# EasyEDA Pro project ZIAD_DBW_PROJECT_EDIT_9_MAY_2025.epro, board DBW_v4.1
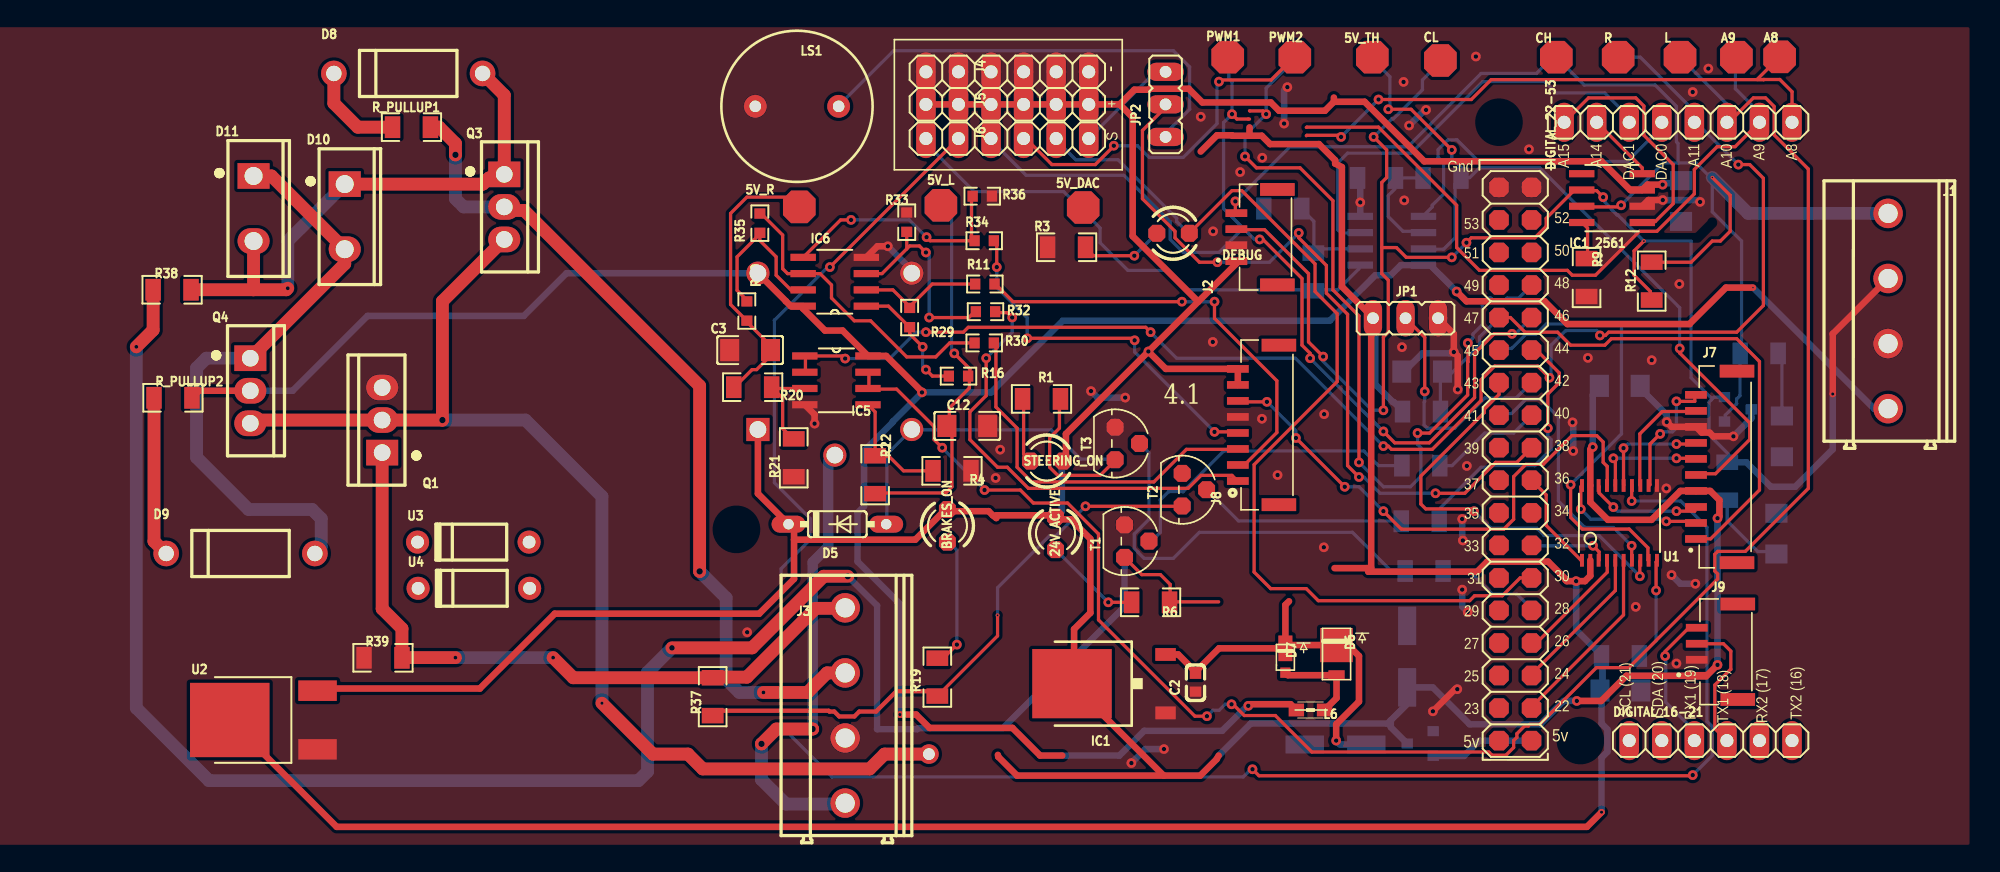
[diagram p13: board, top side]
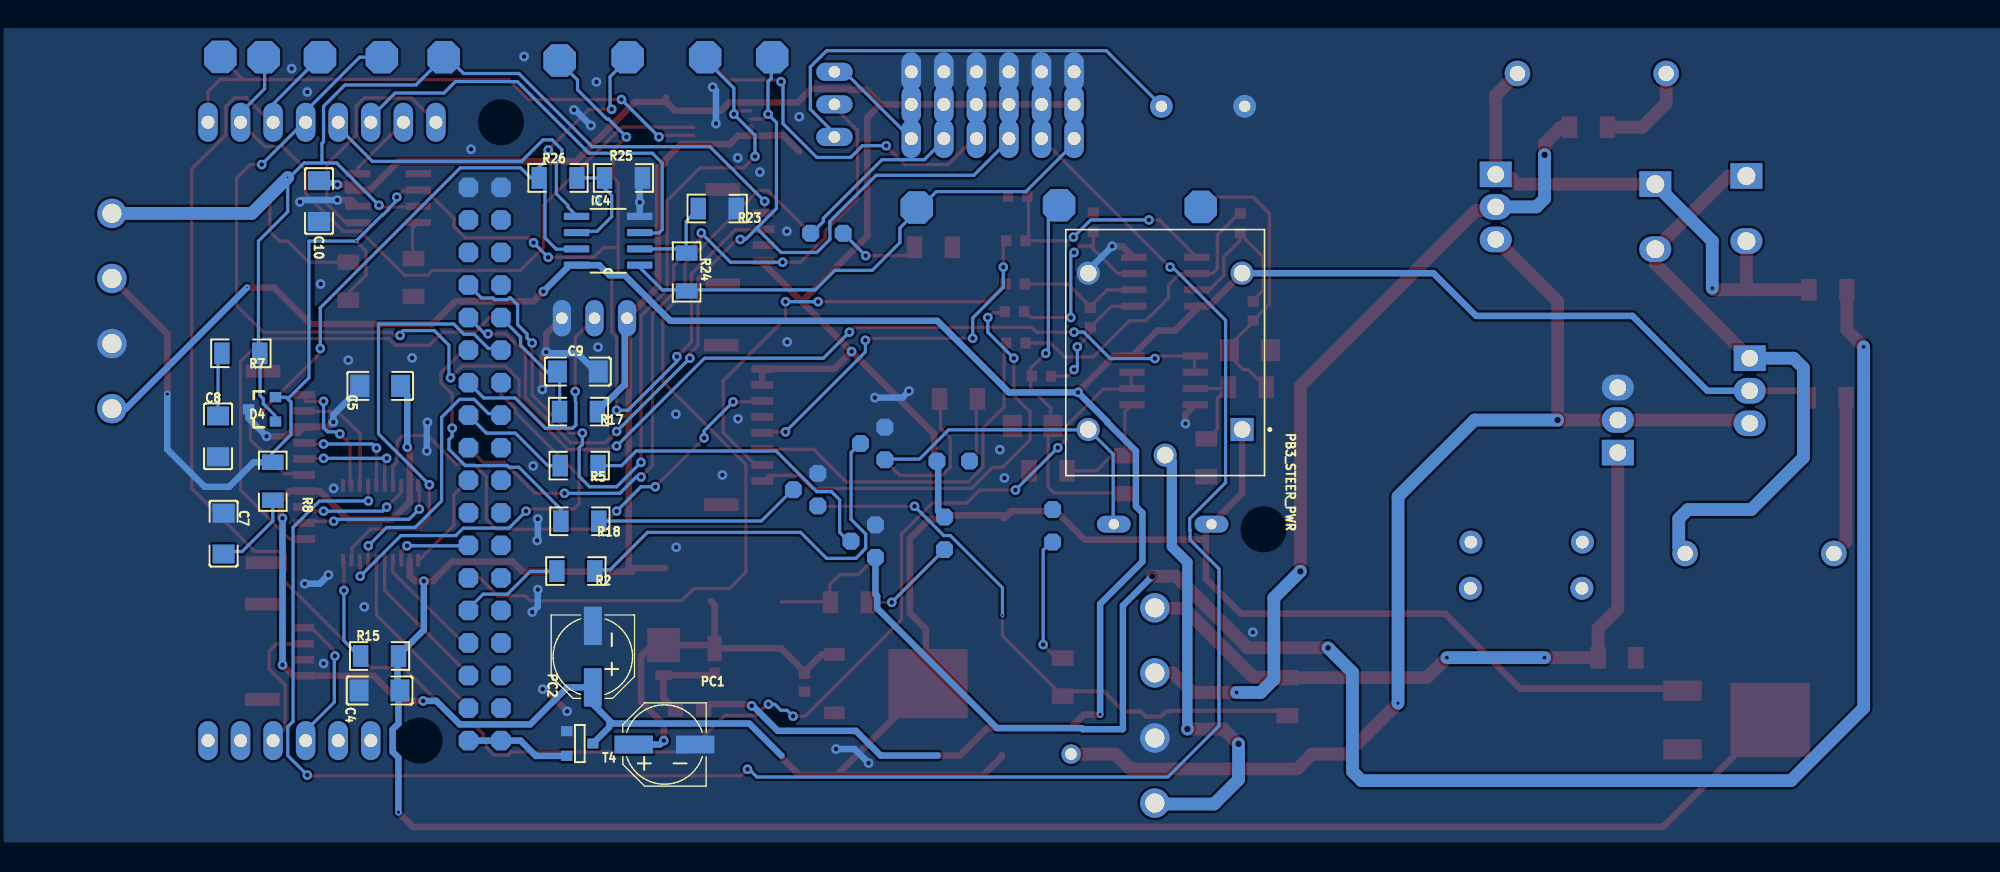
[diagram p14: board, bottom side, seen from below]

Outline 152.02 x 64.06 mm; copper layers: Top Layer, Bottom Layer. Coordinates in mm from the lower left corner of the outline.
Outline path: 0,63.17 0,3.18 ; 53.21,63.93 139.32,63.93 ; 53.34,0 139.45,0 ; 152.02,4.06 152.02,64.06
Stack: Top Layer 0.035mm / Dielectric1 1.51mm FR4 er 4.5 / Bottom Layer 0.035mm

## Design rules (mm)
spacing safeClearance (default): track to track 0.254, other pairs 0.254 to 1.016
spacing Power: track to track 0.254, other pairs 0.254 to 1.016
spacing High Current: track to track 0.762, other pairs 0.762 to 1.016
spacing SPI_Signals: track to track 0.254, other pairs 0.254 to 1.016
spacing Oscillator: track to track 0.508, other pairs 0.508 to 1.016
track width trackWidth (default): min 0.254, default 0.254, max 2.54
track width Power: min 0.508, default 0.508, max 2.54
track width High Current: min 0.508, default 0.508, max 2.54
track width SPI_Signals: min 0.254, default 0.254, max 2.54
track width Oscillator: min 0.254, default 0.254, max 2.54
differential pair differentialPair (default): width min 0.127, default 0.254, max 2.54; gap min 0.152, default 0.152
via viaSize: diameter min 0.35, default 0.35, max 2.6; hole min 0.35, default 0.35, max 2
via default: diameter min 0.305, default 0.305, max 2.6; hole min 0.305, default 0.305, max 2
via Power: diameter min 0.305, default 0.305, max 2.6; hole min 0.305, default 0.305, max 2
via High Current: diameter min 0.305, default 0.305, max 2.6; hole min 0.305, default 0.305, max 2
via SPI_Signals (default): diameter min 0, default 0, max 2.6; hole min 0, default 0, max 2
via Oscillator: diameter min 0, default 0, max 2.6; hole min 0, default 0, max 2
net GND uses CopperRegion1, Power
net ARD+5V uses Power
net 12V_PROTECTION uses Power
net +3V3 uses Power
net +12V uses Power
net +5V uses Power
net +24V uses High Current
net 12V_OUT uses High Current
net SOLENOID_POWER uses High Current
pour ie1 uses CopperRegion

## Placement (name value [footprint] x y rotation side)
5V_DAC  PTR1PAD1-17  [P1-17]  82.5 49.86 0 top
5V_L  PTR1PAD1-17  [P1-17]  71.4 50.04 0 top
5V_R  PTR1PAD1-17  [P1-17]  60.35 49.91 0 top
5V_TH  PTR1PAD1-17  [P1-17]  105.05 61.6 0 top
24V_ACTIVE  LED3  [LED3MM]  80.34 24.44 270 top
A8  PTR1PAD1-17  [P1-17]  136.83 61.62 0 top
A9  PTR1PAD1-17  [P1-17]  133.45 61.6 0 top
ANALOG_A8-A15  ANALOG_A8-A15  [1X08]  128.91 56.52 180 top
BRAKES_ON  LED2  [LED3MM]  71.91 25.02 270 top
C2  100n  [C0603]  91.26 12.78 90 top
C3  1uF  [C1206]  56.51 38.74 180 top
C4  0.1uF  [C1206]  124.41 12.17 0 bottom
C5  0.1uF  [C1206]  124.36 35.94 0 bottom
C7  560pF  [C1206]  136.58 24.41 90 bottom
C8  560pF  [C1206]  137.01 32 270 bottom
C9  1uF  [C1206]  108.94 37.06 180 bottom
C10  0.1uF  [C1206]  129.13 50.37 270 bottom
C12  1uF  [C1206]  73.46 32.82 0 top
CH  PTR1PAD1-17  [P1-17]  119.41 61.6 180 top
CL  PTR1PAD1-17  [P1-17]  110.36 61.34 0 top
D4  PESD1CAN  [SPARKFUN-DISCRETESEMI_SOT23-3]  133.53 34.11 90 bottom
D5  1N4148DO35-7  [DO35-7]  63.32 25.15 0 top
D6  SS1P3L  [DO220AAL]  102.26 15.01 270 top
D7  MSS1P3L-M3/89A  [MICROSMP]  98.27 14.76 270 top
D8  P6KE15A  [DO-15_BD3.1-L6.7-P10.70-D0.9-RD]  29.84 60.33 0 top
D9  P6KE15A  [DO-15_BD3.1-L6.7-P10.70-D0.9-RD]  16.76 22.86 0 top
D10  MBR1045  [TO-220AC_L10.0-W4.5-P5.08-T]  24.89 49.15 0 top
D11  MBR1045  [TO-220AC_L10.0-W4.5-P5.08-T]  17.78 49.78 0 top
DEBUG  DS1  [LED3MM]  89.51 47.85 180 top
DIGITAL_16-21  DIGITAL_16-21  [1X06]  131.44 8.26 0 top
DIGITAL_22-53  Digital 22-53  [PINHEAD_2X18]  116.2 29.85 270 top
IC1  MC33269?D  [DPACK]  84.12 12.7 90 top
IC1_2561  MCP2561-E/SN  [SOIC8-N_MC_MCH]  123.75 50.6 180 top
IC4  LM358D  [D8]  106.58 47.27 0 bottom
IC5  LM358D  [D8]  63.25 36.37 0 top
IC6  LM358D  [D8]  63.12 44.07 180 top
J1  DB128V-5.08-4P-GN-S  [CONN-TH_4P-P5.08_DIBO_DB128V-5.08]  145.29 41.78 90 top
J2  CAN_2  [JST_SM04B-GHS-TB(LF)(SN)-]  96.72 47.55 90 top
J3  DB128V-5.08-4P-GN-S  [CONN-TH_4P-P5.08_DIBO_DB128V-5.08]  63.93 11 90 top
J4  Ground  [1X06]  76.58 60.45 0 top
J5  Power  [1X06]  76.58 57.91 0 top
J6  Signal  [1X06]  76.58 55.25 0 top
J7  MOTOR  [JST_SM10B-GHS-TB(LF)(SN)]  133.5 29.62 90 top
J8  STEERING  [JST_SM08B-GHS-TB(LF)(SN)]  94.56 32.89 90 top
J9  ROS_CONN  [JST_SM04B-GHS-TB(LF)(SN)-]  132.64 15.19 90 top
JP1  3 pin  [JP2]  107.64 41.22 0 top
JP2  3 pin  [JP2]  88.93 57.91 90 top
L  PTR1PAD1-17  [P1-17]  129.06 61.6 0 top
L6  MH2029-300Y  [0805]  100.23 10.64 180 top
LS1  BUZZER-PTH  [BUZZER-12MM]  60.17 57.76 0 top
NOREF  -  [Pad_e752]  70.47 7.2 0 top
PB3_STEER_PWR  ORWH-SH-105D1F,000  [TE_ORWH-SH-105D1F,000]  57.12 32.54 90 bottom
PC1  47u  [PANASONIC_D]  102.18 7.95 0 bottom
PC2  47u  [PANASONIC_D]  107.77 14.81 270 bottom
PWM1  PTR1PAD1-17  [P1-17]  93.78 61.6 0 top
PWM2  PTR1PAD1-17  [P1-17]  99.01 61.6 0 top
Q1  IRLZ44NPBF  [TO-220-3_L10.0-W4.5-P2.54-T]  27.81 33.27 180 top
Q3  IRF4905PBF  [TO-220-3_L10.0-W4.5-P2.54-T]  37.34 49.91 0 top
Q4  IRF4905PBF  [TO-220-3_L10.0-W4.5-P2.54-T]  17.53 35.56 0 top
R  PTR1PAD1-17  [P1-17]  124.23 61.6 0 top
R1  1K  [R1206]  79.25 34.93 180 top
R2  1K  [R1206]  109.09 21.49 180 bottom
R3  1K  [R1206]  81.2 46.76 0 top
R4  10K  [R1206]  72.26 29.31 180 top
R5  1K  [R1206]  108.84 29.72 180 bottom
R6  1K  [R1206]  87.76 19.05 180 top
R7  100  [R1206]  135.23 38.48 180 bottom
R8  100  [R1206]  132.74 28.5 90 bottom
R9  4.7k  [R1206]  121.77 44.4 90 top
R10  4.7K  [R0603]  56.26 41.78 90 top
R11  22k  [R0603]  74.83 43.89 180 top
R12  120  [R1206]  126.85 44.12 90 top
R15  10K  [R1206]  124.41 14.86 180 bottom
R16  4.7K  [R0603]  72.77 36.7 180 top
R17  4.7K  [R1206]  108.89 33.93 0 bottom
R18  1K  [R1206]  108.79 25.37 180 bottom
R19  1K  [R1206]  71.12 13.21 90 top
R20  5.151K  [R1206]  56.72 35.84 180 top
R21  10K  [R1206]  59.92 30.33 270 top
R22  5.151K  [R1206]  66.27 29.01 270 top
R23  10K  [R1206]  98.07 49.78 0 bottom
R24  5.151K  [R1206]  100.46 44.83 270 bottom
R25  10K  [R1206]  105.38 52.17 0 bottom
R26  5.151K  [R1206]  110.49 52.17 0 bottom
R29  22k  [R0603]  68.96 41.28 90 top
R30  22k  [R0603]  74.78 39.29 0 top
R32  22k  [R0603]  74.88 41.73 180 top
R33  22k  [R0603]  68.73 48.72 270 top
R34  22k  [R0603]  74.78 47.27 180 top
R35  22k  [R0603]  57.28 48.64 270 top
R36  22k  [R0603]  74.62 50.75 0 top
R37  150  [R1206]  53.59 11.68 90 top
R38  100  [R1206]  11.42 43.44 0 top
R39  10K  [R1206]  27.88 14.72 0 top
R_PULLUP1  10K  [R1206]  30.1 56.13 180 top
R_PULLUP2  10K  [R1206]  11.49 35.01 0 top
STEERING_ON  LED1  [LED3MM]  79.65 30.07 180 top
T1  2N3904  [TO92]  85.72 23.83 270 top
T2  2N3904  [TO92]  90.22 27.84 270 top
T3  2N3904  [TO92]  84.99 31.45 270 top
T4  PMV48XP  [SOT-23]  108.79 8 90 bottom
U1  TXB0108PWR  [TSSOP20]  124.33 25.25 0 top
U2  LM1117DT-2.5/NOPB  [TO-252-2_L6.6-W6.1-P4.57-LS9.7-BR-CW]  19.35 9.86 0 top
U3  1N5819  [DO-41_BD2.4-L4.7-P8.70-D0.6-RD]  34.92 23.75 0 top
U4  1N5819  [DO-41_BD2.4-L4.7-P8.70-D0.6-RD]  34.97 20.14 0 top

## Footprints (pads in the part's own frame, mm; a bottom-side part is the same pattern mirrored in y, then rotated)
1X06
  oval 1.524x3.048 hole 1.016: 1(-6.35,0) 2(-3.81,0) 3(-1.27,0) 4(1.27,0) 5(3.81,0) 6(6.35,0)
1X08
  oval 1.524x3.048 hole 1.016: 1(-8.89,0) 2(-6.35,0) 3(-3.81,0) 4(-1.27,0) 5(1.27,0) 6(3.81,0) 7(6.35,0) 8(8.89,0)
0805
  rect 1.2x1 smd: 1(-1.1,0) 2(1.1,0)
BUZZER-12MM
  round 1.778 hole 0.9: +(3.25,0) -(-3.25,0)
C0603
  rect 0.8x0.9 smd: 1(-0.7,0) 2(0.7,0)
C1206
  rect 1.485x1.728 smd: 1(-1.593,0) 2(1.593,0)
CONN-TH_4P-P5.08_DIBO_DB128V-5.08
  round 2.3 hole 1.5: 1(-7.62,0) 2(-2.54,0) 3(2.54,0) 4(7.62,0)
D8
  rect 1.981x0.559 smd: 1(-2.464,1.905) 2(-2.464,0.635) 3(-2.464,-0.635) 4(-2.464,-1.905) 5(2.464,-1.905) 6(2.464,-0.635) 7(2.464,0.635) 8(2.464,1.905)
DO35-7
  oval 2.642x1.321 hole 0.813: A(3.81,0) C(-3.81,0)
DO220AAL
  rect 2.667x2.54 smd: P$1(-0.7,0)
  rect 0.762x1.27 smd: P$2(1.65,0)
DO-15_BD3.1-L6.7-P10.70-D0.9-RD
  round 2 hole 1.2: 1(-5.8,0) 2(5.8,0)
DO-41_BD2.4-L4.7-P8.70-D0.6-RD
  round 1.8 hole 1: 1(-4.35,0) 2(4.35,0)
DPACK
  rect 1x1.6 smd: 1(-2.28,-4.8) 3(2.28,-4.8)
  rect 5.4x6.2 smd: 2(0,2.5)
JP2
  oval 1.423x2.845 hole 0.914: 1(-2.54,0) 2(0,0) 3(2.54,0)
JST_SM04B-GHS-TB(LF)(SN)-
  rect 0.6x1.7 smd: 1(-1.875,2.275) 2(-0.625,2.275) 3(0.625,2.275) 4(1.875,2.275)
  rect 1x2.7 smd: SH1(-3.725,-0.925) SH2(3.725,-0.925)
JST_SM08B-GHS-TB(LF)(SN)
  rect 0.6x1.7 smd: 1(-4.375,0) 2(-3.125,0) 3(-1.875,0) 4(-0.625,0) 5(0.625,0) 6(1.875,0) 7(3.125,0) 8(4.375,0)
  rect 1x2.7 smd: SH1(-6.225,-3.2) SH2(6.225,-3.2)
JST_SM10B-GHS-TB(LF)(SN)
  rect 0.6x1.7 smd: 1(-5.625,3.2) 2(-4.375,3.2) 3(-3.125,3.2) 4(-1.875,3.2) 5(-0.625,3.2) 6(0.625,3.2) 7(1.875,3.2) 8(3.125,3.2) 9(4.375,3.2) 10(5.625,3.2)
  rect 1x2.7 smd: S1(-7.475,0) S2(7.475,0)
LED3MM
  custom 1.321x1.321 hole 0.813: A(-1.27,0) K(1.27,0)
MICROSMP
  rect 0.8x0.8 smd: A(1.2,0)
  rect 2x1.1 smd: K(-0.7,0)
P1-17
  custom 2.54x2.54 hole 1.702: TP(0,0)
Pad_e752
  round 1.524 hole 0.914: 1(0,0)
PANASONIC_D
  rect 3x1.4 smd: +(2.4,0) -(-2.4,0)
PINHEAD_2X18
  custom 1.524x1.524 hole 1.016: 1(-21.59,-1.27) 2(-21.59,1.27) 3(-19.05,-1.27) 4(-19.05,1.27) 5(-16.51,-1.27) 6(-16.51,1.27) 7(-13.97,-1.27) 8(-13.97,1.27) 9(-11.43,-1.27) 10(-11.43,1.27) 11(-8.89,-1.27) 12(-8.89,1.27) 13(-6.35,-1.27) 14(-6.35,1.27) 15(-3.81,-1.27) 16(-3.81,1.27) 17(-1.27,-1.27) 18(-1.27,1.27) 19(1.27,-1.27) 20(1.27,1.27) 21(3.81,-1.27) 22(3.81,1.27) 23(6.35,-1.27) 24(6.35,1.27) 25(8.89,-1.27) 26(8.89,1.27) 27(11.43,-1.27) 28(11.43,1.27) 29(13.97,-1.27) 30(13.97,1.27) 31(16.51,-1.27) 32(16.51,1.27) 33(19.05,-1.27) 34(19.05,1.27) 35(21.59,-1.27) 36(21.59,1.27)
R0603
  rect 0.806x0.864 smd: 1(-0.753,0) 2(0.753,0)
R1206
  rect 1.208x1.701 smd: 1(-1.479,0) 2(1.479,0)
SOIC8-N_MC_MCH
  rect 1.981x0.559 smd: 1(-2.362,1.905) 2(-2.362,0.635) 3(-2.362,-0.635) 4(-2.362,-1.905) 5(2.362,-1.905) 6(2.362,-0.635) 7(2.362,0.635) 8(2.362,1.905)
SOT-23
  rect 0.787x0.889 smd: 1(0.025,-1.016) 2(-0.94,1.016) 3(0.991,1.016)
SPARKFUN-DISCRETESEMI_SOT23-3
  rect 0.8x0.9 smd: 1(-0.95,-1) 2(0.95,-1) 3(0,1.1)
TE_ORWH-SH-105D1F,000
  rect 1.808x1.808 hole 1.3: 1(0,0)
  round 1.808 hole 1.3: 2(0,12) 3(-2,6) 4(12.2,0) 5(12.2,12)
TO92
  custom 1.321x1.321 hole 0.813: 1(1.27,0) 2(0,1.905) 3(-1.27,0)
TO-220-3_L10.0-W4.5-P2.54-T
  rect 2.5x2 hole 1.3: 1(0,2.54)
  oval 2.5x2 hole 1.3: 2(0,0) 3(0,-2.54)
TO-220AC_L10.0-W4.5-P5.08-T
  rect 2.5x2 hole 1.4: 1(0,2.54)
  oval 2.5x2 hole 1.4: 2(0,-2.54)
TO-252-2_L6.6-W6.1-P4.57-LS9.7-BR-CW
  rect 3x1.6 smd: 1(3.424,-2.29) 3(3.424,2.29)
  rect 6.2x5.8 smd: 2(-3.424,0)
TSSOP20
  rect 0.305x0.991 smd: 1(-2.925,-2.918) 2(-2.275,-2.918) 3(-1.625,-2.918) 4(-0.975,-2.918) 5(-0.325,-2.918) 6(0.325,-2.918) 7(0.975,-2.918) 8(1.625,-2.918) 9(2.275,-2.918) 10(2.925,-2.918) 11(2.925,2.918) 12(2.275,2.918) 13(1.625,2.918) 14(0.975,2.918) 15(0.325,2.918) 16(-0.325,2.918) 17(-0.975,2.918) 18(-1.625,2.918) 19(-2.275,2.918) 20(-2.925,2.918)

## Nets
As in the schematic, except:
+3V3: C4.1 JP1.1 R15.2 R17.1 U1.2 U2.2
SOLENOID_POWER: NOREF.1 Q1.2 Q3.3 Q4.3

Pads without a net: DIGITAL_22-53 3 4 5 6 7 17 19 21 22 23 25 27 29 31 33; IC1_2561 5; J2 SH1 SH2; J7 S1 S2; J8 SH1 SH2; J9 SH1 SH2; U3 1 2; U4 1 2

## Via types
v1: diameter 0.756, hole 0.35, Top Layer to Bottom Layer, 150 vias
v2: diameter 0.5, hole 0.25, Top Layer to Bottom Layer, 4 vias
v3: diameter 0.305, hole 0.15, Top Layer to Bottom Layer, 2 vias
v4: diameter 0.25, hole 0.125, Top Layer to Bottom Layer, 2 vias
v5: diameter 0.5, hole 0.3, Top Layer to Bottom Layer, 4 vias
v6: diameter 1, hole 0.5, Top Layer to Bottom Layer, 5 vias
v7: diameter 0.5, hole 0.5, Top Layer to Bottom Layer, 1 via
v8: diameter 0.75, hole 0.44, Top Layer to Bottom Layer, 1 via
v9: diameter 0.5, hole 0.305, Top Layer to Bottom Layer, 1 via

## Routing (per net, layer and track width the routed paths; a pad name or vN(x,y) marks a point on that pad's centre or on a via; arc(x,y) is an arc through that point)
5V_BRAKE_PULSE: length 155.5
  Top Layer w0.254: v1(95.71,6.02) 96.22,5.51 130,5.51 v1(130.05,5.56) ; v1(125.29,26.96) 125.29,28.07 U1.14 ; 72.85,55.35 72.74,55.21 v1(62.74,45.21)
  Bottom Layer w0.254: v1(95.71,6.02) 95.58,6.02 94.98,5.42 62.91,5.42 58.93,9.4 58.93,11.42 58.95,11.44 58.95,12.59 58.93,12.61 58.93,21.67 61.18,23.92 61.18,24.68 61.21,24.71 61.21,25.58 58.41,28.38 58.41,41.07 62.55,45.21 v1(62.74,45.21) ; v1(130.05,5.56) 131.57,7.09 131.57,9.34 131.16,9.75 131.16,24.89 129.1,26.96 v1(125.29,26.96)
5V_DAC1: length 40.8
  Bottom Layer w0.254: 100.46,43.43 100.46,43.41 ; 100.46,43.43 102.36,43.43 104.01,45.09 104.01,45.34 IC4.1 ; 100.46,43.43 90.42,43.43 88.9,44.96 85.98,44.96 83.82,47.12 83.82,48.26 82.55,49.53 82.55,49.78 5V_DAC.TP 82.42,49.91 82.17,49.91 80.97,51.11 73.99,51.11 70.36,54.74 70.36,55.25 70.31,55.35
5V_EBIKE_POWER_IN: length 10
  Top Layer w0.254: v1(128.78,34.73) 130.21,34.73 130.21,35.21 J7.10 ; U1.12 126.71,28.23 126.71,31.4 v1(127.51,32.19)
  Bottom Layer w0.254: v1(127.51,32.19) 127.67,32.35 128.46,32.35 128.78,32.67 v1(128.78,34.73)
5V_FWDSW: length 11.3
  Top Layer w0.254: v1(121.32,26.32) 121.32,28.07 U1.20 ; v1(127.98,25.37) 130.21,25.37 J7.2
  Bottom Layer w0.254: v1(127.98,25.37) 127.83,25.53 122.11,25.53 v1(121.32,26.32)
5V_L_SENSE: length 29.9
  Top Layer w0.254: v1(72.44,38.48) 73.66,37.26 73.66,36.7 73.62,36.7 73.62,35.78 72.06,34.21 72.06,32.82 72.26,32.61 72.26,28.07 71.78,27.59 66.27,27.59
  Bottom Layer w0.254: v1(72.44,38.48) 72.24,38.68 72.24,49.2 5V_L.TP
5V_R_SENSE: length 22.3
  Top Layer w0.254: 55.3,35.84 56.67,37.21 57.02,37.21 57.91,38.1 57.91,39.28 56.26,40.93 56.26,41.02 54.99,42.29 54.99,49.4 56.26,50.67 59.59,50.67 5V_R.TP
5V_REGEN: length 8.7
  Top Layer w0.254: v1(124.65,31.08) 124.65,28.23 U1.15 ; v1(128.78,31.4) 130.21,31.4 J7.7
  Bottom Layer w0.254: v1(128.78,31.4) 124.97,31.4 v1(124.65,31.08)
5V_REVERSE: length 8.6
  Top Layer w0.254: U1.16 124.02,28.23 124.02,30.13 v1(123.86,30.29) ; J7.6 130.21,30.29 v1(128.78,30.29)
  Bottom Layer w0.254: v1(128.78,30.29) v1(123.86,30.29)
5V_SPEEDOMETER: length 9.2
  Top Layer w0.254: U1.13 125.92,28.23 125.92,32.19 127.67,33.94 130.21,33.94 J7.9
5V_STEER_PULSE: length 41.7
  Top Layer w0.254: U1.17 123.38,28.23 123.38,29.65 123.06,29.97 123.06,31.56 122.56,32.06 120.63,32.06 118.38,29.81 117.03,29.81 116.08,28.86 116.08,25.53 115.31,24.76 107.32,24.76 v1(105.92,26.16) ; J8.6 94.65,34.73 94.69,34.7 v1(96.83,34.7) ; v1(99.09,31.88) v1(102.9,28.07)
  Bottom Layer w0.254: v1(105.92,26.16) 104.01,28.07 v1(102.9,28.07) ; v1(96.83,34.7) 99.09,32.44 v1(99.09,31.88)
5V_THROTTLE: length 61.1
  Top Layer w0.254: v1(111.25,54.36) 108.08,57.53 v1(106.3,57.53) ; v1(129.03,38.86) 129.03,38.51 134.49,33.05 134.49,31.75 131.83,29.08 130.43,29.08 J7.5
  Bottom Layer w0.254: 111.91,52.17 112.01,52.2 112.65,52.2 113.41,52.96 118.11,52.96 129.03,42.04 v1(129.03,38.86) ; 111.91,52.17 111.89,52.07 111.51,51.69 111.51,47.5 110.62,46.61 109.09,46.61 109.04,46.63 ; 111.91,52.17 112.01,52.32 112.01,52.96 111.25,53.72 v1(111.25,54.36) ; v1(106.3,57.53) 106.43,57.66 106.43,60.07 105.16,61.34 105.16,61.6 5V_TH.TP
5V_WATCHDOG: length 9
  Top Layer w0.254: U1.18 122.75,28.07 122.75,27.59 v1(123.86,26.48) ; J7.3 130.21,26.48 130.21,26.16 v1(128.78,26.16)
  Bottom Layer w0.254: v1(128.78,26.16) 124.17,26.16 v1(123.86,26.48)
12V_OUT: length 36.7
  Top Layer w1: v6(57.4,8) 58.56,9.16 v6(61.39,9.16)
  Bottom Layer w0.813: PB3_STEER_PWR.3 62.6,30.02 62.6,23.38 61.39,22.17 v6(61.39,9.16)
  Bottom Layer w1: J3.1 63.86,3.3 59.31,3.3 57.4,5.21 v6(57.4,8)
12V_PROTECTION: length 30.5
  Top Layer w0.508: D7.K 93.09,15.46 91.26,13.63 89.91,14.98 IC1.3 ; D7.K 98.27,18.85 98.55,19.13 ; D7.K 98.53,15.71 D6.P$1 103.16,15.71 104.01,14.86 104.01,11.3 102.23,9.53 v1(102.23,8.26)
  Bottom Layer w0.508: v1(102.23,8.26) 102.54,7.95 PC1.+
+3V3: length 207.2
  Top Layer w0.508: 104.75,21.44 113.23,21.44 114.02,22.23 118.77,22.23 120.12,20.88 120.12,20.8 120.22,20.7 v1(120.95,20.7) 121.64,20.7 122.06,21.12 U1.2 ; 104.75,21.44 104.65,21.72 102.11,21.72 ; 104.75,21.44 104.97,21.72 104.97,41.08 JP1.1 104.97,41.4 102.68,43.69 102.68,53.02 102.16,53.29 102.16,53.55 100.89,54.81 97.08,54.81 96.43,55.46 95.47,55.46 ; 95.47,55.46 95.47,56.11 ; 95.47,55.46 94.14,55.46 94.11,55.5 92.94,55.5 91.67,54.23 ; U2.2 24.26,1.52 121.79,1.52 v2(122.94,2.67)
  Bottom Layer w0.508: v1(120.95,20.7) 120.95,16.89 123.01,14.84 123.01,12.17 ; 107.47,33.93 106.73,34.67 106.67,34.67 105.34,36 105.28,36 105.28,41.08 JP1.1 ; C4.1 122.94,12.05 122.94,9.59 123.39,9.13 123.39,7.38 122.94,6.93 v2(122.94,2.67)
+5V: length 317.5
  Top Layer w0.508: 88.77,5.52 91.63,5.52 92.9,6.79 93.07,7.09 ; 88.77,5.52 81.79,12.51 IC1.2 81.79,12.83 81.79,16.95 83.06,18.22 83.06,24 81.53,25.53 80.52,25.53 24V_ACTIVE.A 80.2,25.84 75.76,25.84 75.72,25.63 75.44,25.84 75.12,26.16 71.95,26.16 BRAKES_ON.A 71.63,26.16 69.41,23.94 59.94,23.94 ; 88.77,5.52 77.34,5.52 75.87,6.99 75.84,7.14 ; 59.94,23.94 59.94,20.88 57.23,18.16 41.27,18.16 35.43,12.32 22.94,12.32 U2.3 ; 59.94,23.94 59.94,24.71 D5.C 57.12,27.53 PB3_STEER_PWR.1 ; v1(121.01,11.35) 122.91,11.35 124.87,13.31 131.13,13.31 v1(131.98,14.17) ; v1(87.59,38.63) 88.94,37.27 J8.8 J8.7 ; v1(87.59,38.63) 81.15,32.19 81.15,30.29 STEERING_ON.A ; v1(87.59,38.63) 91.47,42.51 ; 85.34,57.91 83.06,57.91 83.01,57.89 82.74,57.91 80.52,57.91 80.47,57.89 80.2,57.91 77.98,57.91 77.93,57.89 77.66,57.91 75.44,57.91 75.39,57.89 75.12,57.91 72.9,57.91 72.85,57.89 72.58,57.91 70.36,57.91 70.31,57.89 ; 85.34,57.91 86.36,56.9 86.36,47.63 91.47,42.51 ; 85.34,57.91 86.49,59.06 87.63,59.06 87.71,59.13 90.73,59.13 91.8,58.06 97.13,58.06 97.78,57.41 101.36,57.41 102.06,58.12 ; 91.47,42.51 94.45,45.49 94.45,45.67 ; 102.06,58.12 104.45,58.12 109.1,53.47 122.94,53.47 125.17,51.23 IC1_2561.3 126.53,51.65 v1(127.7,51.65) ; 102.06,58.12 102.06,58.44 ; v1(122.25,31.17) 122.06,30.97 U1.19 122.06,26.86 123.43,25.49 126.83,25.49 129.09,27.74 J7.4 131.41,27.74 132.13,27.03 132.13,25.76 v1(131.98,25.61)
  Bottom Layer w0.508: 106.5,9.84 107.77,11.11 107.77,12.41 109.77,12.41 112.65,9.53 118.15,9.53 119.98,11.35 v1(121.01,11.35) ; 106.5,9.84 106.5,9.3 T4.1 ; 106.5,9.84 106.25,9.59 95.57,9.59 93.07,7.09 ; v1(131.98,25.61) v1(131.98,14.17) ; 129.13,51.77 127.82,51.77 v1(127.7,51.65) ; 24V_ACTIVE.A 80.52,25.84 80.84,26.16 80.84,29.97 STEERING_ON.A ; v1(122.25,31.17) 122.25,35.23 122.96,35.94
+12V: length 214.2
  Top Layer w0.508: v2(68.2,10.29) 69.47,10.29 70.51,9.25 76.98,9.25 79.14,7.09 80.87,7.09 ; v4(134.75,43.61) 132.64,43.61 129.79,40.77 120.27,40.77 118.49,42.55 112.39,42.55 v1(111.63,43.31) ; L6.2 98.68,11.1 95.5,11.1 v1(95.38,10.97) ; PB3_STEER_PWR.4 59.31,42.55 59.31,42.55 59.69,42.16 IC6.8 60.66,41.96 62.36,40.26 63.73,40.26 65.71,38.28 67.13,38.28 69.92,35.49 v1(69.92,35.43) ; Q4.2 13.52,35.56 R_PULLUP2.2
  Bottom Layer w0.508: v1(95.38,10.97) 95.3,10.97 93.34,9.02 87.25,9.02 85.32,7.09 80.87,7.09 ; v4(134.75,43.61) 144.2,34.16 J1.1 ; Q4.2 20.83,35.56 26.67,41.4 38.86,41.4 42.2,44.74 PB3_STEER_PWR.4 ; v1(111.63,43.31) 109.58,45.36 107.27,45.36 106.49,44.58 105.28,44.58 101.73,41.02 80.9,41.02 75.31,35.43 v1(69.92,35.43) 67.64,33.15 67.64,33.1 65.41,30.86 65.41,26.54 64.9,26.04 64.9,22.23 68.2,18.92 v2(68.2,10.29)
+24V: length 66
  Top Layer w1: Q3.2 37.62,49.63 38.89,49.63 52.58,35.94 v6(52.58,21.46) ; v6(33.53,53.98) 33.53,54.86 32.26,56.13 R_PULLUP1.1 ; 63.93,13.54 62.52,13.54 61,12.01 v5(57.56,12.01)
  Bottom Layer w1: Q3.2 34.16,49.91 33.53,50.55 v6(33.53,53.98) ; v6(52.58,21.46) 54.65,19.4 54.65,13.05 55.68,12.01 v5(57.56,12.01)
GND: length 58.6
  Top Layer w0.508: v1(133.22,32) 131.66,32 131.36,32.3 130.74,32.3 J7.8 128.4,32.74 v1(128.02,33.12) ; IC6.4 66.45,46.84 v1(67.26,46.84) ; IC1_2561.2 126.59,50.44 v1(127.71,50.44) ; v1(111.72,35.66) 111.72,38.28 v1(111.41,38.58) 111.41,40 JP1.3 ; IC5.4 61.54,33.71 v1(61.54,32.99) ; v1(111.68,12.27) 111.51,12.27 v1(109.78,10.54)
  Bottom Layer w0.508: IC4.4 v1(104.11,50.27) 104.11,52.02 103.96,52.17 ; v1(83.11,35.53) 83.62,35.03 v1(85.78,35.03) ; 125.76,35.94 128.02,33.68 v1(128.02,33.12) ; v1(86.26,6.5) 87.35,7.59 v1(88.8,7.59) ; 107.54,37.06 108.96,38.48 111.13,38.48 111.24,38.58 v1(111.41,38.58) ; v1(109.25,57.48) 109.14,57.48 v1(107.92,56.26) ; PB3_STEER_PWR.5 69.12,44.97 v1(67.26,46.84) ; v1(112.06,25.55) 112.06,23.93 v1(112.12,23.88) ; v1(128.4,21.18) 129.08,20.5 v1(130.25,20.5) ; v1(127.71,50.44) 130.48,50.44 v1(130.62,50.3) ; v1(133.22,32) 134.63,33.41 D4.3 ; v1(112.5,18.29) 112.06,18.72 v1(112.06,20.04) ; v1(120.68,33.1) 120.73,33.05 v1(120.73,30.86) ; v1(98.42,59.26) 98.17,59 v1(98.17,56.41)
  vias: v1(56.29,16.71) v1(75.67,28.75) v1(76.02,30.96) v1(91.67,56.95) v1(92.63,48.01) v1(92.61,39.37) v1(94.74,52.63) v1(96.44,33.38) v1(96.47,53.75) v1(97.66,28.98) v1(101.29,33.73) v1(101.27,23.34) v1(107.37,38.96) v1(107.49,59.66) v1(107.54,50.42) v1(112.43,29.69) v1(113.13,61.65) v1(117.27,54.41) v1(121.87,38.13) v1(125.6,18.69) v1(126.85,37.95) v1(127.99,27.94) v1(128.78,14.28) v1(129.01,43.89) v1(130.05,58.88) v1(131.27,60.71)
ARD+5V: length 8.2
  Bottom Layer w0.508: DIGITAL_22-53.36 DIGITAL_22-53.35 113.41,8.26 112.22,7.06 109.8,7.06
BRAKE_ON: length 21
  Top Layer w0.254: v1(118.75,32.64) 118.75,35.31 119.63,36.2 119.63,36.96 117.86,38.74 DIGITAL_22-53.12
  Bottom Layer w0.254: 110.21,25.37 110.24,25.4 110.24,26.29 113.54,29.59 114.3,29.59 114.43,29.72 117.73,29.72 119,30.99 119,31.75 118.75,32 v1(118.75,32.64)
BRAKE_PULSE: length 20.6
  Top Layer w0.254: v1(125.29,23.46) 125.29,22.35 U1.7
  Bottom Layer w0.254: DIGITAL_22-53.15 114.97,33.78 115.92,33.78 117.03,34.89 118.17,34.89 119.57,33.49 119.57,26.96 121.63,24.89 123.86,24.89 v1(125.29,23.46)
BRAKE_VOLT: length 8.8
  Bottom Layer w0.254: DIGITAL_22-53.16 116.08,32.26 113.82,32.26 111.28,29.72 110.26,29.72
BUZZER: length 60.1
  Top Layer w0.254: v1(104.01,28.83) 103.12,29.72 103.12,41.53 101.47,43.18 101.47,45.34 99.31,47.5 v1(99.31,47.88) ; v1(92.96,45.59) 91.57,45.59 89.66,47.5 89.66,48.01 87.12,50.55 87.12,55.88 88.9,57.66 88.9,57.91 JP2.2 ; v1(109.98,27.56) 112.27,27.56 114.68,29.97 116.33,29.97 DIGITAL_22-53.18
  Bottom Layer w0.254: v1(104.01,28.83) 104.39,28.83 105.66,27.56 v1(109.98,27.56) ; v1(92.96,45.59) 97.03,45.59 v1(99.31,47.88)
CAN_ENABLE: length 18.9
  Top Layer w0.254: JP1.2 109.14,39.73 v1(109.14,35.51)
  Bottom Layer w0.254: DIGITAL_22-53.14 116.28,35 113.84,35 111.48,32.64 109.35,32.64 109.09,32.89 109.09,34.67 109.13,34.71 109.13,34.99 109.14,35.01 v1(109.14,35.51)
CANH: length 105.7
  Top Layer w0.254: 126.85,45.54 126.87,45.59 129.92,45.59 131.57,47.24 132.21,47.24 132.97,48.01 132.97,50.81 v4(131.57,52.21) ; v1(124.46,50.04) 124.33,49.91 121.41,49.91 IC1_2561.7 ; 94.45,49.42 94.37,49.42 v1(94.37,50.34)
  Bottom Layer w0.254: D4.1 132.59,33.27 132.59,33.66 133.48,34.54 133.48,34.93 133.73,35.18 133.73,38.48 133.86,38.48 133.86,47.24 131.57,49.53 v4(131.57,52.21) 131.44,52.21 130.3,53.34 128.91,53.34 ; v1(94.37,50.34) 98.63,54.61 107.82,54.61 113.54,60.33 117.86,60.33 119.13,61.6 CH.TP 121.58,59.42 127.11,59.42 128.78,57.76 128.78,54.99 128.91,54.86 128.91,53.34 ; v1(124.46,50.04) 127.76,53.34 128.91,53.34
  Bottom Layer w1: v4(131.57,52.21) 134.38,49.4 J1.4
CANL: length 130.5
  Top Layer w0.254: 94.45,48.17 94.49,48.13 96.65,48.13 100.08,44.7 100.08,39.37 v1(101.22,38.23) ; v1(112.39,47.12) 112.78,47.5 117.73,47.5 118.62,48.39 118.62,49.02 120.78,51.18 121.28,51.18 IC1_2561.6 121.41,51.18 122.56,51.18 v1(123.06,50.67) ; 126.85,42.7 126.75,42.8 126.75,43.31 125.48,44.58 125.48,46.48 v3(126.24,47.24) ; 105.79,46.74 106.93,46.74 107.7,45.97 v1(111.25,45.97) ; 105.79,46.74 105.79,51.82 106.17,52.2 106.17,54.36 v1(105.16,55.37) ; 105.79,46.74 105.79,44.7 106.3,44.2 106.3,40.13 105.92,39.75 v1(105.92,34.04)
  Top Layer w0.508: J1.3 140.97,40.01 v2(140.97,35.31)
  Bottom Layer w0.254: 131.51,34.86 131.51,34.99 129.92,36.58 129.92,47.24 v3(126.24,47.24) 124.2,49.28 124.15,49.28 123.7,49.72 123.7,49.78 123.19,50.29 123.19,50.55 v1(123.06,50.67) ; 131.51,34.86 131.32,34.67 131.32,32.13 132.84,30.61 132.84,29.98 ; 131.51,34.86 131.7,35.05 132.46,35.05 D4.2 ; CL.TP 110.36,61.21 108.97,59.82 108.97,59.06 106.68,56.77 106.55,56.77 v1(105.16,55.37) ; v1(101.22,38.23) 101.22,37.85 105.03,34.04 v1(105.92,34.04) ; v1(111.25,45.97) v1(112.39,47.12)
  Bottom Layer w0.508: v2(140.97,35.31) 140.97,30.99 138.05,28.07 136.14,28.07 134.23,29.98 R8.2
DAC1: length 34
  Bottom Layer w0.254: IC4.3 104.01,47.88 102.62,47.88 102.36,48.13 102.36,53.34 103.12,54.1 108.08,54.1 113.66,59.69 118.49,59.69 119.38,58.8 123.19,58.8 125.09,56.9 ANALOG_A8-A15.6
DBW_LED: length 78
  Top Layer w0.254: DEBUG.A 94.11,51.18 94.87,51.18 100.58,45.47 100.58,43.31 102.31,41.58 102.31,36.27 95.83,29.79 95.83,21.41 97.13,20.12 99.9,20.12 100.84,19.18 112.65,19.18 113.03,19.56 115.19,19.56 116.59,20.96 DIGITAL_22-53.26
  Bottom Layer w0.254: 80.47,55.35 80.52,55.25 80.52,54.99 81.91,53.59 85.22,53.59 89.79,49.02 89.79,48.77 90.68,47.88 DEBUG.A
EBIKE_POWER_IN: length 35.2
  Top Layer w0.254: v1(120.52,28.23) 120.52,25.68 121.44,24.77 125.09,24.77 126.56,23.3 126.56,22.35 U1.9
  Bottom Layer w0.254: DIGITAL_22-53.11 114.97,38.86 115.92,38.86 117.03,39.97 117.82,39.97 118.62,40.77 124.49,40.77 124.49,32.19 v1(120.52,28.23)
EXTERNAL_BUZZER: length 8
  Bottom Layer w0.254: 83.01,55.35 83.06,55.37 88.14,60.45 JP2.3
FWDSW: length 7.9
  Top Layer w0.254: U1.1 121.32,22.35 118.62,25.05 118.62,27.43 DIGITAL_22-53.20
INTERNAL_BUZZER: length 36
  Bottom Layer w0.254: LS1.+ 63.42,57.81 67.72,62.1 89.53,62.1 90.81,60.83 90.81,57.53 89.03,55.75 89.03,55.37 88.93,55.37
IRPT_WHEEL: length 48.7
  Top Layer w0.254: J7.1 130.43,24 131.44,24 135.25,27.81 135.25,37.85 133.48,39.62 123.7,39.62 123.19,39.12 120.52,39.12 119.51,40.13 116.97,40.13 115.82,41.28 DIGITAL_22-53.9
  Bottom Layer w0.254: 110.31,33.93 110.36,34.04 110.36,36.96 110.34,37.06 110.49,36.96 111.25,36.96 113.41,39.12 113.41,39.75 DIGITAL_22-53.9
L_ANGLE: length 35.4
  Top Layer w0.254: J8.1 94.49,28.58 94.11,28.96 91.69,28.96 90.68,27.94 78.23,27.94 76.58,29.59 75.82,29.59 73.66,31.75 73.66,33.91 74.93,35.18 v1(74.93,38.1) ; 75.73,41.73 75.82,41.66 76.58,41.66 v1(76.96,41.28)
  Bottom Layer w0.254: v1(74.93,38.1) 76.96,40.13 v1(76.96,41.28)
L_RTN: length 34
  Top Layer w0.254: J8.2 94.65,29.81 95.12,29.81 97.61,32.3 97.61,36.34 92.74,41.21 v1(92.74,42.51) ; 75.68,43.89 75.76,43.78 77.03,42.51 v1(90.2,42.51)
  Bottom Layer w0.254: v1(92.74,42.51) v1(90.2,42.51)
L_SENSE: length 144.7
  Top Layer w0.254: v1(71.5,31.12) 70.87,31.75 70.87,32.77 67.94,35.69 65.79,35.69 IC5.6 65.79,35.81 65.79,36.96 IC5.7 ; v1(74.8,27.81) 77.6,27.81 78.61,26.8 81.28,26.8 83.69,24.38 83.69,17.68 91.21,10.16 v1(92.15,10.16) ; ANALOG_A8-A15.3 132.88,56.52 134.78,58.42 135.73,58.42 136.4,57.75 136.4,55.53 139.06,52.87 139.06,27.94 134.15,23.02 131.99,23.02 131.77,22.8 131.77,21.48 131.99,21.26 131.99,20.87 125.07,13.95 122.53,13.95 118.11,9.53 117.35,9.53 117.22,9.4 116.94,9.4 116.33,8.79 116.33,8.51 116.08,8.26 116.08,7.72 115.47,7.11 114.4,7.11 114.14,7.37 100.34,7.37 97.49,10.21 95.06,10.21 94.19,11.09 v1(94.07,11.09)
  Bottom Layer w0.254: ANALOG_A8-A15.3 132.72,57.94 L.TP ; v1(94.07,11.09) 93.57,11.09 93.1,10.62 92.61,10.62 v1(92.15,10.16) ; v1(74.8,27.81) v1(71.5,31.12)
LL_CANRX: length 5.5
  Top Layer w0.254: ANALOG_A8-A15.7 126.11,52.96 IC1_2561.4
LL_CANTX: length 18.9
  Top Layer w0.254: IC1_2561.1 126.11,48.77 127.13,48.77 128.52,50.17 128.52,53.21 126.24,55.5 126.24,57.79 125.6,58.42 121.92,58.42 ANALOG_A8-A15.8
N$2: length 24.7
  Bottom Layer w0.254: T1.2 87.83,23.83 88.52,24.51 88.52,27.05 89.15,27.69 90.3,27.69 93.47,30.86 104.39,30.86 105.54,29.72 107.42,29.72
N$3: length 5.2
  Bottom Layer w0.254: 136.65,38.48 137.01,38.13 137.01,33.4
N$4: length 7.7
  Top Layer w0.254: v1(84.45,19.05) 86.34,19.05
  Bottom Layer w0.254: 24V_ACTIVE.K v1(84.45,19.05)
N$5: length 32.6
  Bottom Layer w0.254: T3.2 87,31.37 87.63,30.73 87.63,25.53 86.49,24.38 86.49,23.27 86.77,22.99 86.77,22.96 87.25,22.48 89.53,22.48 91.57,24.51 103.5,24.51 106.43,21.59 107.57,21.59 107.67,21.49
N$6: length 7.2
  Top Layer w0.508: D7.A 98.47,13.36 D6.P$2 102.26,11.57 L6.1
N$7: length 16.2
  Bottom Layer w0.254: 107.37,25.37 107.31,25.4 94.61,25.4 92.2,27.81 T2.2
N$8: length 36.7
  Top Layer w0.254: T3.1 84.96,30.1 83.82,28.96 80.52,28.96 79.88,29.59 79.88,31.88 80.64,32.64 80.64,34.93 80.67,34.93
  Bottom Layer w0.254: D5.A 67.18,25.15 67.18,30.61 69.09,32.51 PB3_STEER_PWR.2 69.22,32.51 80.01,32.51 82.3,30.23 84.96,30.23 T3.1
N$9: length 6.5
  Bottom Layer w0.254: 136.58,23.01 135.13,23.01 132.74,25.4 132.74,27.08
N$10: length 5.1
  Top Layer w0.254: 77.83,34.93 77.85,34.93 77.85,30.61 STEERING_ON.K
N$13: length 10.4
  Top Layer w0.254: 71.12,14.63 71.12,14.73 71.63,14.73 v1(72.64,15.75)
  Bottom Layer w0.254: BRAKES_ON.K 72.01,23.75 72.64,23.11 v1(72.64,15.75)
N$14: length 9.7
  Top Layer w0.254: 73.98,43.89 70.73,43.89 68.96,42.13 67.65,43.43 IC6.2
N$15: length 15.9
  Top Layer w0.254: v1(70.23,46.36) 69.72,46.86 68.96,46.86 68.73,46.63 ; v1(70.48,41.28) 73.57,41.28 74.03,41.73 ; 68.73,46.63 66.8,44.7 IC6.3 ; 68.73,46.63 68.73,47.87
  Bottom Layer w0.254: v1(70.23,46.36) 70.48,46.1 v1(70.48,41.28)
N$16: length 6.6
  Top Layer w0.254: 82.63,46.76 83.29,46.1 v1(86.49,46.1)
  Bottom Layer w0.254: DEBUG.K v1(86.49,46.1)
N$17: length 9.3
  Top Layer w0.254: 70.84,29.31 68.48,29.31 67.36,30.43 66.27,30.43 66.27,33.91 IC5.5
N$18: length 7.7
  Bottom Layer w0.254: 100.5,46.29 100.84,46.63 IC4.2 ; 100.5,46.29 100.5,48.78 99.49,49.78 ; 100.5,46.29 100.46,46.25
N$19: length 8.8
  Bottom Layer w0.254: 109.04,47.9 108.97,48.01 107.44,48.01 106.3,49.15 106.3,50.8 106.81,51.31 106.81,52.17 109.07,52.17
N$20: length 8.1
  Top Layer w0.254: 127.26,22.33 127.19,22.19 v1(127.19,19.97)
  Bottom Layer w0.254: v1(127.19,19.97) 127.19,16.05 126,14.86 125.83,14.86
N$22: length 9.8
  Top Layer w0.254: IC6.1 67.31,42.16 68.96,40.51 68.96,40 v1(69.98,38.99) ; 71.92,36.7 70.74,36.7 v1(70.23,37.21)
  Bottom Layer w0.254: v1(70.23,37.21) 69.98,37.47 v1(69.98,38.99)
N$23: length 18.7
  Top Layer w0.254: v1(64.39,48.9) 63.58,48.9 IC6.5 ; 73.78,50.75 73.79,50.67 73.79,47.37 73.93,47.27 70.56,47.27 v1(70.28,47.55)
  Bottom Layer w0.254: v1(64.39,48.9) 68.94,48.9 v1(70.28,47.55)
N$24: length 7.3
  Top Layer w0.254: 58.45,35.59 59.06,34.98 59.06,32.61 59.92,31.75 ; 58.45,35.59 58.6,35.74 IC5.3 ; 58.45,35.59 58.29,35.74 58.24,35.74 58.14,35.84
N$25: length 12.5
  Top Layer w0.254: 56.26,42.63 55.5,43.4 55.5,46.01 57.28,47.79 57.28,47.28 58.55,46.01 58.55,44.58 59.69,43.43 IC6.7
N$26: length 23.9
  Top Layer w0.254: 57.28,49.49 59.06,47.71 59.06,45.09 59.44,44.7 IC6.6 61.98,44.7 62.86,43.82 62.86,42.8 64.64,41.02 65.91,41.02 68.73,38.2 70.99,38.2 72.09,39.29 73.93,39.29
N$44: length 3.1
  Top Layer w0.254: IC1_2561.8 121.41,48.69 121.84,48.26 121.84,45.9 121.77,45.82
PWM_1: length 79.8
  Top Layer w0.254: v1(94.11,57.15) 94.49,56.77 95.38,56.77 95.47,56.76 ; v1(96.27,47.37) 96.52,47.37 99.57,44.32 99.57,39.12 100.2,38.48 v1(100.2,38.1) ; v1(105.92,32.39) 106.81,31.5 109.5,31.5 113.03,35.03 113.03,38.48 114.55,40.01 v1(115.95,40.01)
  Bottom Layer w0.254: v1(115.95,40.01) 116.2,40.01 DIGITAL_22-53.10 ; 94.98,48.25 93.09,46.36 90.3,46.36 89.28,47.37 89.28,48.77 85.67,52.38 78.05,52.38 75.44,54.99 75.44,55.25 75.39,55.35 ; 94.98,48.25 93.45,49.78 93.45,56.49 v1(94.11,57.15) 94.11,59.69 93.85,59.94 93.85,61.6 PWM1.TP ; 94.98,48.25 95.86,47.37 v1(96.27,47.37) ; v1(100.2,38.1) v1(105.92,32.39)
PWM_2: length 95.1
  Top Layer w0.254: v1(108.59,32.26) 109.52,32.26 112.49,35.23 112.49,37.85 112.52,37.82 112.52,39.27 v1(112.51,39.28) ; v1(84.89,54.69) 84.89,54.66 83.44,53.21 80.06,53.21 77.93,55.35 ; PWM2.TP 98.93,61.6 97.16,59.82 93.22,59.82 v1(93.09,59.69) ; v1(104.01,29.97) 104.01,41.4 101.98,43.43 101.98,50.39 99.42,52.96 96.01,52.96 v1(95.12,53.85) ; v1(96.77,57.15) 96.52,57.4 95.5,57.4 95.47,57.41
  Bottom Layer w0.254: v1(84.89,54.69) 86.74,54.69 87.66,53.77 90.3,53.77 92.94,56.41 92.94,59.53 v1(93.09,59.69) ; v1(112.51,39.28) 112.9,39.68 112.9,39.99 113.64,40.72 113.64,42.27 114.17,42.8 114.3,42.8 114.43,42.67 115.44,42.67 115.57,42.8 116.46,42.8 DIGITAL_22-53.8 ; PWM2.TP 98.93,61.6 98.93,61.34 96.77,59.18 v1(96.77,57.15) 95.12,55.5 v1(95.12,53.85) ; v1(108.59,32.26) 108.59,31.37 108.84,31.12 108.84,28.88 108.03,28.07 105.92,28.07 v1(104.01,29.97)
PWM_MOTOR: length 54
  Top Layer w0.254: ANALOG_A8-A15.2 133.35,54.61 131.95,54.61 130.17,52.83 130.17,50.93 127.25,48.01 125.89,48.01 122.46,44.58 120.65,44.58 120.27,44.96 113.41,44.96 111.63,46.74 111.63,50.04 105.54,56.13 99.95,56.13 99.9,56.11
  Bottom Layer w0.254: ANALOG_A8-A15.2 135.25,57.25 133.38,59.13 133.38,61.52 A9.TP
PWM_STEER: length 45.6
  Top Layer w0.254: 135.6,59.86 135.59,59.84 114.33,59.84 112.78,58.29 v1(105.54,58.29) ; 135.6,59.86 136.84,59.86 137.79,58.9 ANALOG_A8-A15.1 ; 135.6,59.86 135.06,59.86 A8.TP ; v1(102.62,55.37) 102.49,55.5 99.95,55.5 99.9,55.46
  Bottom Layer w0.254: v1(105.54,58.29) v1(102.62,55.37)
R_ANGLE: length 28.7
  Top Layer w0.254: v1(75.76,45.21) 75.76,47.12 75.63,47.27 ; J8.4 94.49,32.35 v1(92.74,32.35) ; v1(86.51,39.5) 86.35,39.66 v1(78.14,39.66)
  Bottom Layer w0.254: v1(75.76,45.21) 75.76,43.62 78.14,41.24 v1(78.14,39.66) ; v1(86.51,39.5) 86.51,38.58 v1(92.74,32.35)
R_RTN: length 29.2
  Top Layer w0.254: 75.63,39.29 75.69,39.24 75.69,34.29 77.34,32.64 77.34,29.59 78.49,28.45 88.01,28.45 90.55,30.99 94.49,30.99 J8.3
R_SENSE: length 115
  Top Layer w0.254: IC5.2 60.83,37.08 60.83,38.23 60.78,38.28 63.73,38.28 v1(63.93,38.07) ; v1(70.23,40.13) 73.15,40.13 73.53,40.51 87.38,40.51 v1(87.76,40.13) ; v1(118.87,36.58) 117.96,37.49 114.6,37.49 113.54,36.42 113.54,34.8 109.73,30.99 106.55,30.99 106.3,31.24 v1(105.92,31.24) ; v1(122.81,39.88) 123.23,39.88 123.49,40.13 133.48,40.13 135.56,42.22 135.56,52.15 134.49,53.21 v1(133.6,53.21)
  Bottom Layer w0.254: v1(70.23,40.13) 69.47,40.13 67.41,38.07 v1(63.93,38.07) ; v1(87.76,40.13) 89.79,38.1 99.06,38.1 v1(105.92,31.24) ; R.TP 125.96,61.6 130.17,57.38 ANALOG_A8-A15.4 130.3,56.52 v1(133.6,53.21) ; v1(122.81,39.88) 122.81,40.01 122.56,40.26 120.14,40.26 119,39.12 119,36.7 v1(118.87,36.58)
REGEN: length 14.5
  Top Layer w0.254: U1.6 124.65,22.19 124.65,18.07 117.51,10.92 DIGITAL_22-53.34
REVERSE: length 11.7
  Top Layer w0.254: U1.5 124.02,22.19 124.02,19.97 117.51,13.46 DIGITAL_22-53.32
RX1_DBW: length 11.1
  Top Layer w0.254: v1(127.89,14.86) 127.89,15.21 129.75,17.06 130.36,17.06
  Bottom Layer w0.254: DIGITAL_16-21.3 130.17,9.02 127.94,11.25 127.94,14.81 v1(127.89,14.86)
SOLENOID_OUT: length 54.3
  Top Layer w1: Q1.1 27.81,18.54 29.36,17 R39.2 29.37,14.73 v5(33.53,14.73) ; v5(41.15,14.73) 42.72,13.16 R37.2 53.64,13.21 56.26,13.21 61.63,18.58 64.06,18.58
  Bottom Layer w1: v5(41.15,14.73) v5(33.53,14.73)
SOLENOID_POWER: length 90.3
  Top Layer w1: NOREF.1 67,7.2 65.84,6.05 52.82,6.05 51.67,7.2 48.93,7.2 v2(44.96,11.18) ; Q3.3 32.51,42.55 v6(32.51,33.27) Q1.2 17.78,33.27 Q4.3
  Bottom Layer w1: v6(32.51,33.27) 38.99,33.27 44.96,27.31 v2(44.96,11.18)
SPEEDOMETER: length 32.7
  Top Layer w0.254: U1.8 125.92,22.19 v1(125.92,21.08) ; DIGITAL_22-53.13 114.94,35.27 113.79,34.13 113.79,33.86 108.84,28.91 108.84,26.72 109.22,26.34 112.81,26.34 v1(112.99,26.16)
  Bottom Layer w0.254: v1(112.99,26.16) 114.31,24.84 117.88,24.84 118.46,24.26 122.75,24.26 v1(125.92,21.08)
STEER_ON: length 8.3
  Bottom Layer w0.254: 110.51,21.49 110.62,21.46 112.65,21.46 114.43,19.69 116.33,19.69 117.47,18.54 DIGITAL_22-53.28
STEER_PULSE: length 9.2
  Top Layer w0.254: U1.4 123.38,22.19 123.38,21.4 117.98,16 117.51,16 DIGITAL_22-53.30
THROTTLE: length 26
  Bottom Layer w0.254: ANALOG_A8-A15.5 127.63,56.13 124.97,53.47 113.34,53.47 111.66,55.14 110.95,55.14 110.19,54.38 110.19,53.77 110.62,53.34 110.62,50.93 109.73,50.04 109.73,49.91 109.09,49.28 109.04,49.17
TX1_DBW: length 10.8
  Top Layer w0.254: DIGITAL_16-21.4 131.78,9.2 131.78,12.6 132.99,13.82 133.02,13.82 133.02,15.24 132.45,15.81 130.36,15.81
WATCHDOG: length 6.2
  Top Layer w0.254: v1(122.27,23.46) 122.75,22.99 122.75,22.35 U1.3
  Bottom Layer w0.254: DIGITAL_22-53.24 117.51,23.46 v1(122.27,23.46)
$2N2317: length 7.7
  Top Layer w1: R_PULLUP1.2 25.91,56.13 24.04,58 D8.1
$2N2321: length 47.2
  Top Layer w1: Q4.1 24.89,45.47 D10.2 19.18,52.32 D11.1
  Bottom Layer w1: Q4.1 14.1,38.1 13.33,37.34 13.33,30.35 17.4,26.29 22.35,26.29 23.06,25.58 23.06,23.36 D9.2
$2N2325: length 12.5
  Top Layer w1: D9.1 10.01,23.81 R_PULLUP2.1
$2N2595: length 46.3
  Top Layer w0.25: R19.1 75.82,16.43 v3(75.82,18.03)
  Top Layer w0.254: T2.1 90.17,26.54 v1(82.68,26.54)
  Top Layer w0.33: R19.1 70.74,12.11 67.93,12.11 66.34,10.52 65.03,10.52 64.65,10.14 63.46,10.14 63.08,10.52 62.7,10.52 62.64,10.59 53.97,10.59 R37.1
  Bottom Layer w0.254: v1(82.68,26.54) 80.39,24.26 79.88,24.26 75.82,20.19 v3(75.82,18.03)
$2N2647: length 42.7
  Top Layer w1: D8.2 37.34,58.63 Q3.1 37.06,52.17 36.15,52.17 35.67,51.69 D10.1 ; 17.77,43.44 20.33,43.44 v9(20.45,43.56) ; 17.77,43.44 17.78,43.46 17.78,47.24 ; 17.77,43.44 R38.2
  Bottom Layer w1: D10.1 20.45,47.24 v9(20.45,43.56)
$2N2653: length 151.9
  Top Layer w0.254: 93.07,19.09 89.35,19.09 89.28,19.16 ; 89.28,19.16 89.18,19.05 ; 89.28,19.16 89.28,20.44 88.52,21.21 87.07,21.21 T1.1
  Top Layer w1: v7(64.13,21.08) 62.26,21.08 56.67,15.49 v8(50.42,15.49) ; v5(8.64,38.99) 9.94,40.3 R38.1
  Bottom Layer w0.5: v7(64.13,21.08) 66.42,18.8 66.42,9.14 69.55,9.14 69.63,9.23 76.23,9.23 85.59,18.58 85.59,19.55 85.72,19.69 T1.1
  Bottom Layer w1: v8(50.42,15.49) 48.51,13.59 48.51,5.84 47.81,5.14 14.3,5.14 8.64,10.8 v5(8.64,38.99)

## Copper pours and planes (outline as drawn; the poured copper is in the pictures)
GND on Top Layer: -5.59,0.13 -5.59,63.93 151.64,63.93 151.64,0.13
GND on Bottom Layer: -5.08,0.38 -5.08,63.81 153.67,63.81 153.67,0.38

## Text on the board
Top Silkscreen Layer: 52 | 50 | 48 | 46 | 44 | 42 | 40 | 38 | 36 | 34 | 32 | 30 | 28 | 26 | 24 | 22 | Gnd | 53 | 51 | 49 | 47 | 45 | 43 | 41 | 39 | 37 | 35 | 33 | 29 | 27 | 25 | 23 | 31 | SCL (21) | SDA (20) | RX1 (19) | TX1 (18) | RX2 (17) | TX2 (16) | + | S | A15 | A14 | DAC1 | DAC0 | A11 | A10 | A9 | A8 | 5v | - | 4.1
